# EAGLE design Simple_LNA (EAGLE 7.2.0)
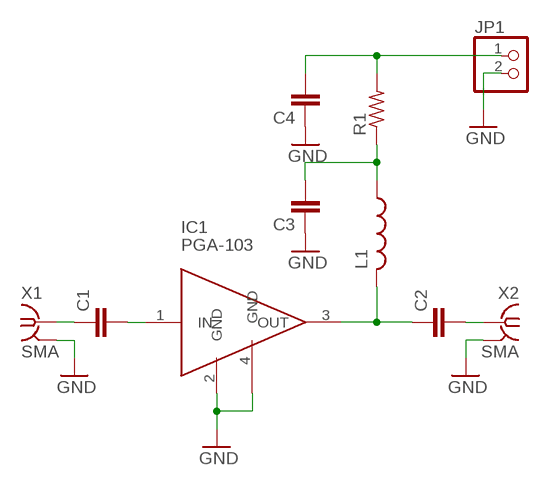
[diagram p0: schematic, sheet 1]

## Parts
C1  C-EUC0805  [C0805]
C2  C-EUC0805  [C0805]
C3  C-EUC0805  [C0805]
C4  C-EUC0805  [C0805]
IC1  PGA-103  [SOT89]
JP1  PINHD-1X2  [1X02]
L1  L-USL3216C  [L3216C]
R1  R-US_R0805  [R0805]
X1  SMA  SMA-142-0701-801/806  [J502-ND-142-0701-801/806]
X2  SMA  SMA-142-0701-801/806  [J502-ND-142-0701-801/806]

## Nets
GND: C3.1 C4.1 IC1.2(GND) IC1.4(GND) JP1.2 X1.G@1 X1.G@2 X1.G@3 X1.G@4 X2.G@1 X2.G@2 X2.G@3 X2.G@4
N$1: C1.1 X1.1
N$2: C1.2 IC1.1(IN)
N$3: C2.2 X2.1
N$4: C2.1 IC1.3(OUT) L1.2
N$5: C4.2 JP1.1 R1.2
N$6: C3.2 L1.1 R1.1

## Library data of the parts
C1-C4 = resistor:C-EU: CAPACITOR, European symbol
IC1 = pga103:PGA-103
JP1 = pinhead:PINHD-1X2: PIN HEADER
L1 = resistor:L-US: INDUCTOR, American symbol
R1 = resistor:R-US_: RESISTOR, American symbol
X1 X2 = con-coax:SMA-: SMA 50 Ohm End Launch Jack Receptacle - Round Contact Johnson Components Source: www.johnsoncomponents.com .. J502-ND.pdf; MF: JOHNSON COMPONENTS; MPN: 142-0701-801; OC_FARNELL: 1608592; OC_NEWARK: 90F2624

## Board
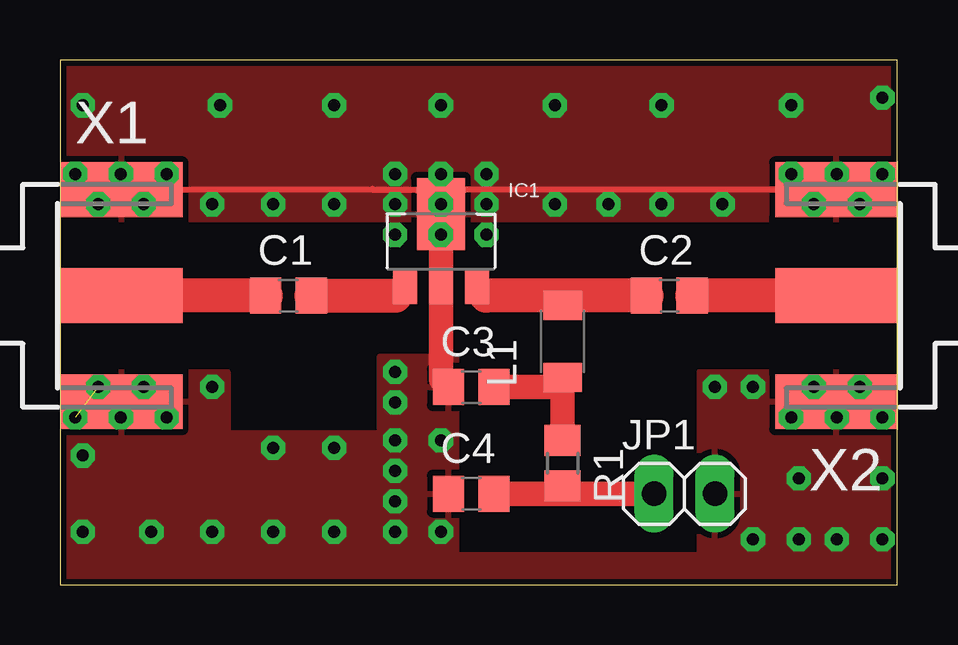
[diagram p1: board, top side]
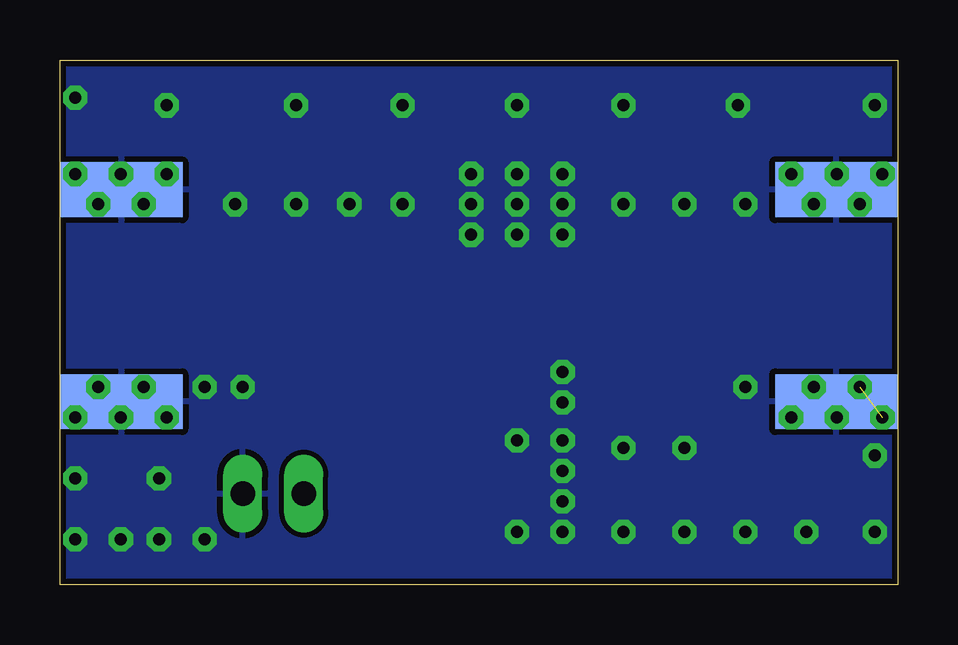
[diagram p2: board, bottom side, seen from below]

Size 34.92 x 21.9 mm. Coordinates in mm from the lower left corner, seen from the top.
Outline: 0,0 34.91,0 34.91,21.9 0,21.9 0,0
Copper layers (1*16): Top 0.035mm / dielectric 1.5mm / Bottom 0.035mm
Design rules "SparkFun": minimum track width 8mil, minimum drill 20mil, track to track 8mil, track to pad 8mil, pad to pad 8mil, via to via 8mil, smd to smd 8mil, copper to edge 10mil, drill to drill 8mil, minimum pad ring 12mil, minimum via ring 10mil, stop-mask expansion 4mil, vias tented up to drill 25mil, thermal gap 10mil

### Footprints (pad centres in the part's own frame; a part is rotated, then mirrored left to right if it is on the bottom)
C0805 = smd 1.3 x 1.5: 1 -0.95,0; 2 0.95,0
SOT89 = smd 1 x 1.5: 1 -1.5,-1.5; 2 0,-1.5; 3 1.5,-1.5 | smd 2 x 3: 4 0,1.5
1X02 = drill 1.016 long: 1 -1.27,0; 2 1.27,0
L3216C = smd 1.2 x 1.6: 1 -1.5,0; 2 1.5,0
R0805 = smd 1.3 x 1.5: 1 -0.95,0; 2 0.95,0
J502-ND-142-0701-801/806 = smd 5.08 x 2.286: 1 2.565,0; G@1 2.565,4.42; G@2 2.565,-4.42 | smd 5.08 x 2.286 bottom: G@3 2.565,4.42; G@4 2.565,-4.42

### Placement (x,y rotation side)
C1  9.53,12.06 0 top
C2  25.4,12.06 0 top
C3  17.14,8.25 0 top
C4  17.14,3.81 0 top
IC1  15.88,13.97 0 top
JP1  26.04,3.81 0 top
L1  20.95,10.16 90 top
R1  20.95,5.08 270 top
X1  0,12.06 0 top
X2  34.92,12.06 180 top

### Tracks (layer width: path | path; a pad name or v marks a point on that pad's centre or on a via)
GND  (via drill 0.5 pad 0.25)  (1 unrouted)
  Top 0.254: X1.G@3 13.02,16.51 13.02,16.48 14.86,16.48 IC1.4 16.89,16.48 X2.G@4
  Top 1.016: IC1.4 IC1.2 15.88,8.57 C3.1
  Bottom 0.254: v3.49,8.25 3.49,7.94 v4.44,6.98 | v0.64,17.15 0.64,16.83 v1.59,15.87 | v3.49,15.87 3.49,16.19 v4.44,17.15 | v30.48,17.15 30.48,16.83 v31.43,15.87 | v33.34,8.25 33.34,7.94 v34.29,6.98 | v34.29,17.15 34.29,16.83 v33.34,15.87 | v31.43,8.25 31.43,7.94 v30.48,6.98
  other vias: 2.54,17.15 0.64,6.98 2.54,6.98 1.59,8.25 13.97,14.6 17.78,14.6 13.97,17.15 17.78,17.15 15.88,17.15 15.88,14.6 13.97,15.87 15.88,15.87 17.78,15.87 13.97,8.89 13.97,7.62 13.97,6.03 15.88,6.03 13.97,4.76 13.97,3.49 13.97,2.22 15.88,2.22 0.95,2.22 0.95,5.4 6.35,8.25 6.35,2.22 3.81,2.22 8.89,2.22 11.43,2.22 8.89,5.71 11.43,5.71 32.38,6.98 32.38,17.15 27.3,8.25 28.89,8.25 28.89,1.91 32.38,1.91 34.29,1.91 30.8,1.91 30.8,4.45 34.29,4.45 20.64,15.87 22.86,15.87 25.08,15.87 27.62,15.87 11.43,15.87 8.89,15.87 6.35,15.87 0.95,20 6.67,20 11.43,20 15.88,20 20.64,20 25.08,20 30.48,20 34.29,20.32
  pour Top: 0,8.89 6.99,8.89 6.99,6.35 13.34,6.35 13.34,9.53 16.51,9.53 16.51,1.27 26.67,1.27 26.67,8.89 34.92,8.89 34.92,0.32 0,0.32
  pour Bottom: 0,21.59 34.92,21.59 34.92,0.32 0,0.32
  pour Top: 0,15.24 0,21.91 34.92,21.91 34.92,15.24
N$1
  Top 1.422: C1.1 X1.1
N$2
  Top 0.61: 13.97,12.06 IC1.1
  Top 1.422: C1.2 13.97,12.06
N$3
  Top 1.422: X2.1 C2.2
N$4
  Top 0.61: 17.78,12.06 IC1.3 | L1.2 20.95,12.06
  Top 1.422: C2.1 20.95,12.06 17.78,12.06
N$5
  Top 1.016: C4.2 20.95,3.81 | 20.95,3.81 JP1.1 | R1.2 20.95,3.81
N$6
  Top 1.016: R1.1 L1.1 20.55,8.25 C3.2